# EAGLE design i2c-bridge-atmega-2 (EAGLE 9.2.1)
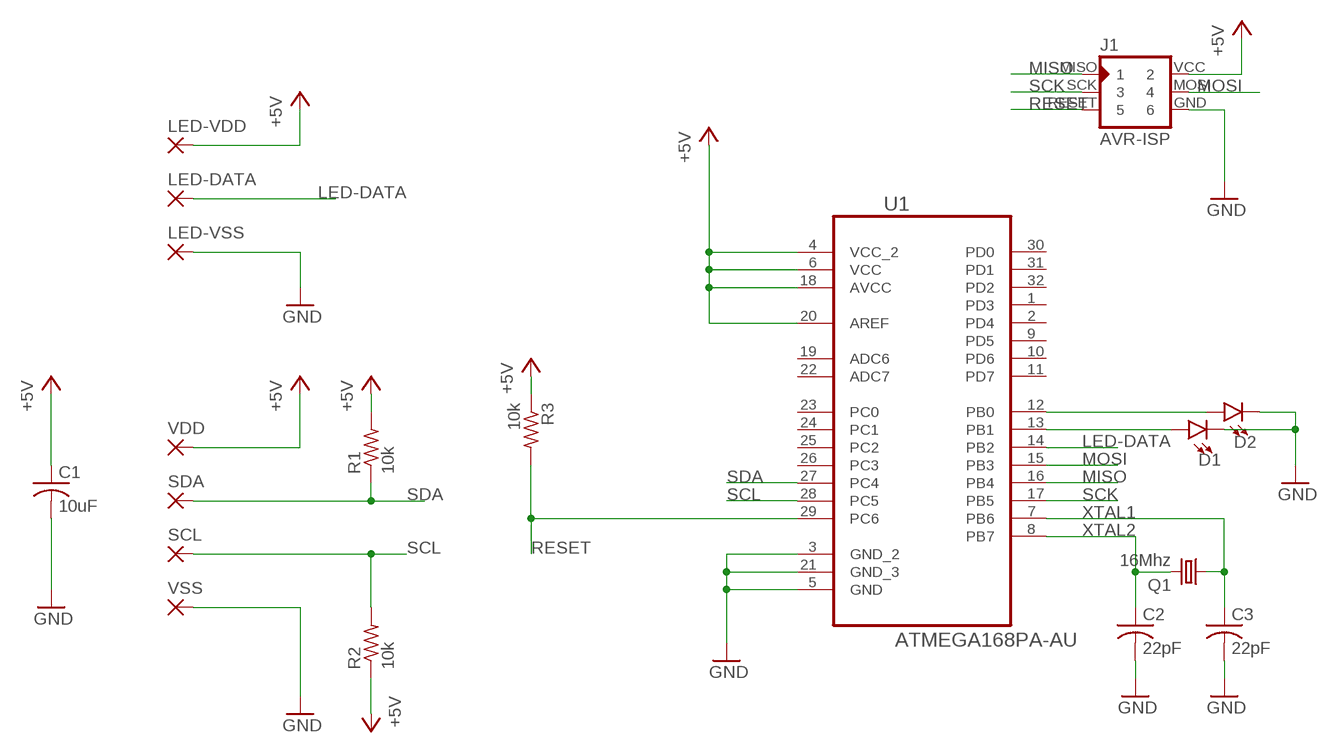
[diagram p0: schematic, sheet 1]

## Parts
C1  10uF  C-USC0805  [C0805]
C2  22pF  C-USC0805  [C0805]
C3  22pF  C-USC0805  [C0805]
D1  WHITE  LED-WHITE1206  [LED-1206]
D2  WHITE  LED-WHITE1206  [LED-1206]
J1  AVR-ISP  AVR-ISP-6PINAVR-ISP-6PIN-SMALL-SILK  [AVR-ISP-6PIN-SMAILL-SILK]
LED-DATA  SMD2  [SMD1,27-2,54]
LED-VDD  SMD2  [SMD1,27-2,54]
LED-VSS  SMD2  [SMD1,27-2,54]
Q1  16Mhz  CSM-7X-DU  [CSM-7X-DU]
R1  10k  R-US_R0805  [R0805]
R2  10k  R-US_R0805  [R0805]
R3  10k  R-US_R0805  [R0805]
SCL  SMD2  [SMD1,27-2,54]
SDA  SMD2  [SMD1,27-2,54]
U1  ATMEGA168PA-AU  [QFP80P900X900X120-32N]
VDD  SMD2  [SMD1,27-2,54]
VSS  SMD2  [SMD1,27-2,54]

## Nets
+5V: C1.1 J1.VCC LED-VDD.1(P) R1.2 R2.1 R3.1 U1.4(VCC_2) U1.6(VCC) U1.18(AVCC) U1.20(AREF) VDD.1(P)
GND: C1.2 C2.2 C3.2 D1.C D2.C J1.GND LED-VSS.1(P) U1.3(GND_2) U1.5(GND) U1.21(GND_3) VSS.1(P)
LED-DATA: LED-DATA.1(P) U1.14(PB2)
MISO: J1.MISO U1.16(PB4)
MOSI: J1.MOSI U1.15(PB3)
N$1: D1.A U1.13(PB1)
N$2: D2.A U1.12(PB0)
RESET: J1.RESET R3.2 U1.29(PC6)
SCK: J1.SCK U1.17(PB5)
SCL: R2.2 SCL.1(P) U1.28(PC5)
SDA: R1.1 SDA.1(P) U1.27(PC4)
XTAL1: C3.1 Q1.1 U1.7(PB6)
XTAL2: C2.1 Q1.2 U1.8(PB7)
Unconnected: U1.1(PD3) U1.2(PD4) U1.9(PD5) U1.10(PD6) U1.11(PD7) U1.19(ADC6) U1.22(ADC7) U1.23(PC0) U1.24(PC1) U1.25(PC2) U1.26(PC3) U1.30(PD0) U1.31(PD1) U1.32(PD2)

## Library data of the parts
C1-C3 = rcl:C-US: CAPACITOR, American symbol; SPICEPREFIX: C
D1 D2 = SparkFun-LED:LED-WHITE: White SMD LED Used in manufacturing several products at SparkFun. Packages: 0603 - Bright White SMD 0603 package[Product Link] <http://www.kingbrightusa.com/product.asp?catalog_name=LED&product_id=APT1608QWF/D> 1206 - Bright White SMD1206 package [Product Link] <http://www.kingbrightusa.com/product.asp?catalog_name=LED&product_id=APT3216QWF/D> 3014 - Super Bright SMD 3014 package [Datasheet] <http://www.lumileds.com/uploads/459/DS208-pdf> SparkFun Products: Blackberry Trackballer Breakout <https://www.sparkfun.com/products/13169> Digital SandBox <https://www.sparkfun.com/products/12651>; PROD_ID: DIO-09955
J1 = avr-isp:AVR-ISP-6PIN: AVR ISP 6pin 3x2 pin header
LED-DATA LED-VDD LED-VSS SCL SDA VDD VSS = wirepad:SMD2: SMD PAD
Q1 = crystal:CSM-7X-DU: SMD CRYSTAL Source: www.ecsxtal.com .. Crystal 3.6864MHz CSM_7X_DU.PDF; OC_FARNELL: unknown; OC_NEWARK: unknown
R1-R3 = rcl:R-US_: RESISTOR, American symbol; SPICEPREFIX: R
U1 = Atmel_By_element14_Batch_1-00:ATMEGA168PA-AU: 8-bit Microcontroller; MPN: ATMEGA168PA-AU; OC_FARNELL: 1748516; OC_NEWARK: 26R5629; PACKAGE: TQFP-32; SUPPLIER: Atmel

## Board
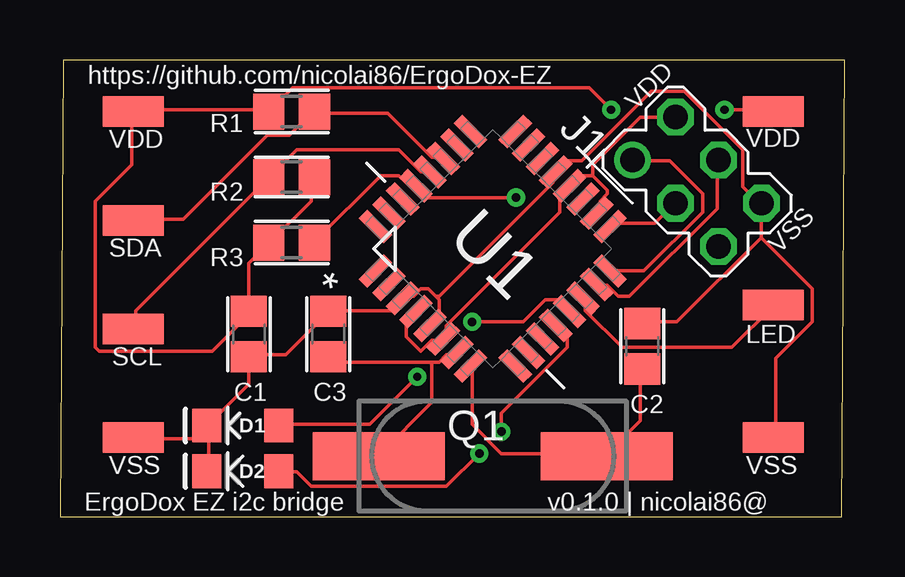
[diagram p1: board, top side]
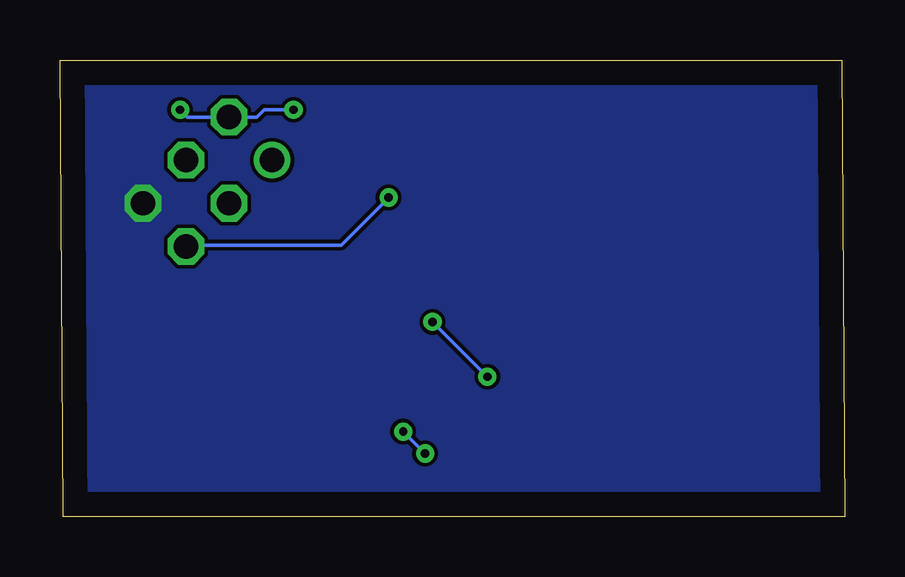
[diagram p2: board, bottom side, seen from below]

Size 32.69 x 19.04 mm. Coordinates in mm from the lower left corner, seen from the top.
Outline: 0,0 32.56,0 32.69,19.04 0.13,19.04 0,0
Copper layers (1*16): Top 0.035mm / dielectric 1.5mm / Bottom 0.035mm
Design rules "default": minimum track width 6mil, minimum drill 0.35mm, track to track 6mil, track to pad 6mil, pad to pad 6mil, via to via 6mil, smd to smd 6mil, copper to edge 40mil, drill to drill 6mil, minimum pad ring 10mil, minimum via ring 8mil, stop-mask expansion 4mil, vias tented up to drill 0mil, thermal gap 10mil

### Footprints (pad centres in the part's own frame; a part is rotated, then mirrored left to right if it is on the bottom)
C0805 = smd 1.3 x 1.5: 1 -0.95,0; 2 0.95,0
LED-1206 = smd 1.2 x 1.4: A -1.5,0; C 1.5,0
AVR-ISP-6PIN-SMAILL-SILK = drill 1.016 octagon: GND 1.27,-2.54; MOSI 1.27,0; RESET -1.27,-2.54; SCK -1.27,0; VCC 1.27,2.54 | drill 1.016: MISO -1.27,2.54
SMD1,27-2,54 = smd 1.27 x 2.54: 1 0,0
CSM-7X-DU = smd 5.5 x 2: 1 -4.75,0; 2 4.75,0
R0805 = smd 1.3 x 1.5: 1 -0.95,0; 2 0.95,0
QFP80P900X900X120-32N = smd 1.473 x 0.508: 1 -4.115,2.794; 2 -4.115,2.007; 3 -4.115,1.194; 4 -4.115,0.406; 5 -4.115,-0.406; 6 -4.115,-1.194; 7 -4.115,-2.007; 8 -4.115,-2.794; 17 4.115,-2.794; 18 4.115,-2.007; 19 4.115,-1.194; 20 4.115,-0.406; 21 4.115,0.406; 22 4.115,1.194; 23 4.115,2.007; 24 4.115,2.794 | smd 0.508 x 1.473: 9 -2.794,-4.115; 10 -2.007,-4.115; 11 -1.194,-4.115; 12 -0.406,-4.115; 13 0.406,-4.115; 14 1.194,-4.115; 15 2.007,-4.115; 16 2.794,-4.115; 25 2.794,4.115; 26 2.007,4.115; 27 1.194,4.115; 28 0.406,4.115; 29 -0.406,4.115; 30 -1.194,4.115; 31 -2.007,4.115; 32 -2.794,4.115

### Placement (x,y rotation side)
C1  7.87,7.62 270 top
C2  24.26,7.11 90 top
C3  11.18,7.62 90 top
D1  7.62,3.81 180 top
D2  7.62,1.91 180 top
J1  26.54,13.97 45 top
LED-DATA  29.72,8.83 90 top
LED-VDD  29.72,16.89 90 top
LED-VSS  29.72,3.3 90 top
Q1  18.03,2.54 0 top
R1  9.65,16.89 180 top
R2  9.65,14.16 180 top
R3  9.65,11.43 0 top
SCL  3.05,7.83 90 top
SDA  3.05,12.36 90 top
U1  18.03,11.18 45 top
VDD  3.05,16.89 90 top
VSS  3.05,3.3 270 top

### Tracks (layer width: path | path; a pad name or v marks a point on that pad's centre or on a via)
+5V  (via drill 0.35)
  Top 0.152: R2.1 10.46,14.07 10.46,13.16 8.79,11.48 R3.1 8.64,11.33 7.87,10.57 C1.1 7.87,8.43 6.35,6.91 1.63,6.91 1.47,7.06 1.47,13.16 3,14.68 3,16.82 VDD.1 3.15,16.97 8.64,16.97 R1.2 8.79,16.97 9.7,17.88 22.05,17.88 v22.96,16.97 | v27.69,16.97 29.67,16.97 LED-VDD.1 | U1.4 14.73,8.43 14.43,8.13 14.43,7.52 15.04,6.91 15.49,7.37 15.95,7.37 U1.6 16.1,7.52 16.1,7.98 20.83,12.7 20.83,13.46 21.13,13.77 U1.20 21.29,13.92 21.59,14.22 22.2,14.22 | 22.2,14.22 22.81,13.61 22.81,13.46 22.5,13.16 22.5,12.7 U1.18 | 22.2,14.22 22.2,14.68 24.18,16.66 25.55,16.66 J1.VCC
  Bottom 0.152: v27.69,16.97 27.38,16.66 25.7,16.66 J1.VCC 25.55,16.66 24.49,16.66 24.18,16.97 v22.96,16.97
GND
  Top 0.152: 29.21,11.63 25.7,8.13 24.33,8.13 C2.2 | 29.21,13 29.21,11.63 | 29.21,11.63 31.34,9.5 31.34,8.13 29.82,6.6 29.82,3.4 LED-VSS.1 | 6.2,3.25 6.2,3.71 D1.C | 6.2,3.25 6.2,2.03 D2.C | D1.C 6.2,3.86 7.87,5.54 C1.2 7.87,6.76 9.4,6.76 11.07,8.43 C3.2 11.23,8.59 13.82,8.59 14.27,9.04 U1.3 14.43,9.2 14.73,9.2 15.04,9.5 15.34,9.5 15.65,9.2 | 6.2,3.25 3.15,3.25 VSS.1 | 6.2,3.25 D1.C | 15.65,9.2 15.8,9.04 15.8,8.43 15.49,8.13 U1.5 | 15.65,9.2 15.8,9.2 20.52,13.92 20.52,14.22 U1.21 20.68,14.38 21.13,14.83 21.74,14.83 24.64,17.73 26.01,17.73 28.45,15.29 28.45,13.77 29.21,13 | 29.21,13 J1.GND
  pour Bottom (no thermals): 0.25,18.92 32.38,18.92 32.38,0.13 0.25,0.13
LED-DATA
  Top 0.152: U1.14 21.89,9.04 21.89,8.59 23.42,7.06 27.99,7.06 29.67,8.74 LED-DATA.1
MISO
  Top 0.152: U1.16 22.96,10.26 24.33,10.26 26.77,12.7 26.77,13.46 25.4,14.83 23.88,14.83 J1.MISO
MOSI
  Top 0.152: U1.15 22.5,9.65 22.81,9.65 23.27,9.2 23.72,9.2 27.38,12.85 27.38,14.83 J1.MOSI
N$1  (via drill 0.35)
  Top 0.152: v14.88,5.84 12.9,3.86 9.25,3.86 D1.A | v17.17,8.13 19.3,8.13 20.22,9.04 20.68,9.04 21.13,8.59 U1.13
  Bottom 0.152: v17.17,8.13 v14.88,5.84
N$2  (via drill 0.35)
  Top 0.152: v17.48,2.64 16.1,1.27 10.46,1.27 9.86,1.88 9.25,1.88 D2.A | v18.39,3.56 18.39,4.32 21.13,7.06 21.13,7.52 20.68,7.98 U1.12
  Bottom 0.152: v18.39,3.56 v17.48,2.64
RESET  (via drill 0.35)
  Top 0.152: R3.2 10.62,11.48 13.36,14.22 14.12,14.22 14.43,13.92 14.73,13.92 U1.29 14.88,13.77 15.34,13.31 v19,13.31
  Bottom 0.152: v19,13.31 20.98,11.33 27.38,11.33 J1.RESET
SCK
  Top 0.152: U1.17 22.96,12.24 24.79,12.24 25.55,13 J1.SCK
SCL
  Top 0.152: U1.28 15.34,14.38 15.04,14.38 14.12,15.29 9.86,15.29 8.79,14.22 R2.2 8.64,14.07 3.15,8.59 3.15,7.98 SCL.1
SDA
  Top 0.152: U1.27 15.95,14.99 15.49,14.99 13.66,16.82 10.62,16.82 R1.1 10.46,16.82 9.55,15.9 8.64,15.9 5.13,12.39 3.15,12.39 SDA.1
XTAL1
  Top 0.152: 15.49,6.45 11.38,6.45 11.23,6.6 C3.1 | 15.49,6.45 15.8,6.45 16.1,6.76 16.41,6.76 U1.7 | 15.49,6.45 15.49,4.78 13.36,2.64 Q1.1
XTAL2
  Top 0.152: U1.8 17.17,6.15 17.17,3.86 18.39,2.64 22.66,2.64 Q1.2 22.81,2.64 24.18,4.01 24.18,6.15 C2.1

### Text on the board
tPlace: https://github.com/nicolai86/ErgoDox-EZ | VDD | VDD | VSS | LED | VSS | ErgoDox EZ i2c bridge v0.1.0 | nicolai86@